# EasyEDA Pro project Chassis924.epro

# Schematic Schematic1
Create Date: 2024-09-16; Page Name: P1; Project Name: 底盘控制模块916; Schematic Name: Schematic1; Update Date: 2024-09-16; Company: 嘉立创EDA; Page Size: A4; Version: V1.0
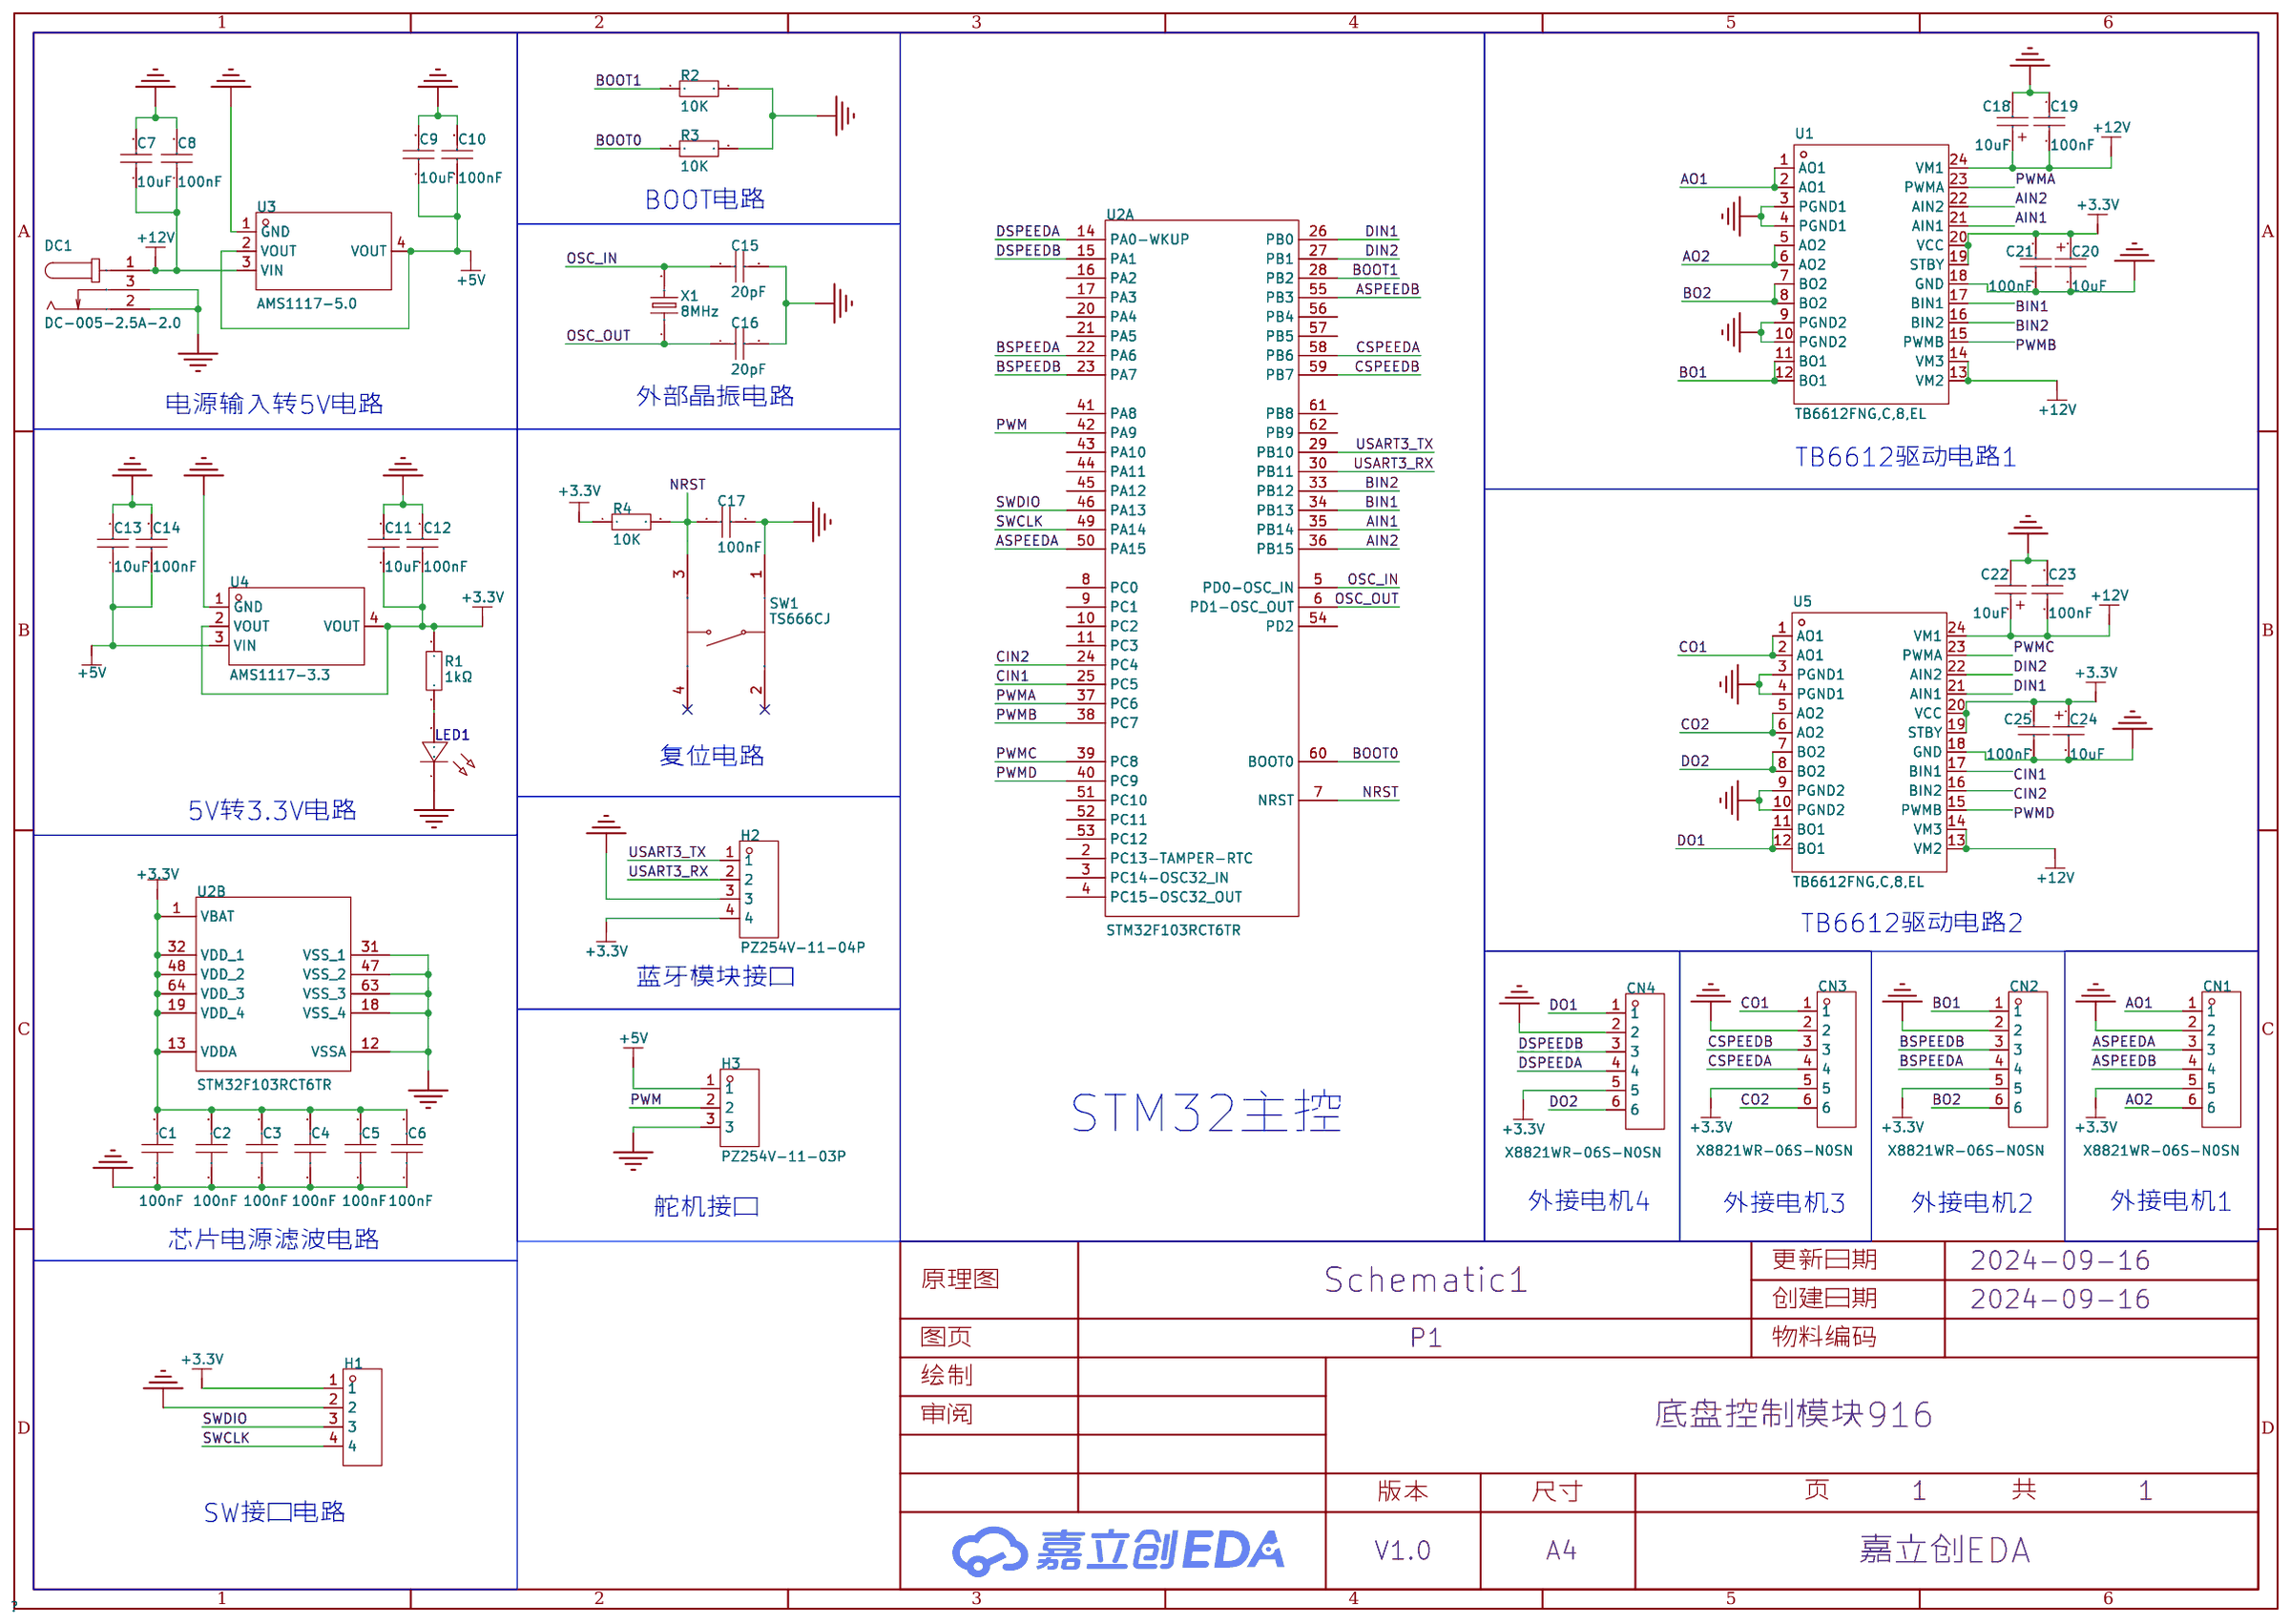
[diagram p0: schematic sheet]

## Parts
C1  100nF  [C0603]
C2  100nF  [C0603]
C3  100nF  [C0603]
C4  100nF  [C0603]
C5  100nF  [C0603]
C6  100nF  [C0603]
C7  10uF  [C0402]
C8  100nF  [C0402]
C9  10uF  [C0402]
C10  100nF  [C0402]
C11  10uF  [C0402]
C12  100nF  [C0402]
C13  10uF  [C0402]
C14  100nF  [C0402]
C15  20pF  [C0402]
C16  20pF  [C0402]
C17  100nF  [C0402]
C18  10uF  [CAP-SMD_L3.2-W1.6-RD-C7171]
C19  100nF  [C0402]
C20  10uF  [CAP-SMD_L3.2-W1.6-RD-C7171]
C21  100nF  [C0402]
C22  10uF  [CAP-SMD_L3.2-W1.6-RD-C7171]
C23  100nF  [C0402]
C24  10uF  [CAP-SMD_L3.2-W1.6-RD-C7171]
C25  100nF  [C0402]
CN1  X8821WR-06S-N0SN  [CONN-TH_6P-P2.50_X8821WR-06S-N2SN]
CN2  X8821WR-06S-N0SN  [CONN-TH_6P-P2.50_X8821WR-06S-N2SN]
CN3  X8821WR-06S-N0SN  [CONN-TH_6P-P2.50_X8821WR-06S-N2SN]
CN4  X8821WR-06S-N0SN  [CONN-TH_6P-P2.50_X8821WR-06S-N2SN]
DC1  DC-005-2.5A-2.0  [CONN-TH_DC-005-2.5A-2.0]
H1  -  [HDR-TH_4P-P2.54-V-M]
H2  PZ254V-11-04P  [HDR-TH_4P-P2.54-V-M]
H3  PZ254V-11-03P  [HDR-TH_3P-P2.54-V-M]
LED1  -  [LED_0805]
R1  1kΩ  [R0603]
R2  10K  [R0603]
R3  10K  [R0603]
R4  10K  [R0603]
SW1  TS666CJ  [SW-TH_4P-L6.0-W6.0-P4.50-LS6.5]
U1  TB6612FNG,C,8,EL  [SSOP-24_L8.3-W5.6-P0.65-LS7.6-BL]
U2  STM32F103RCT6TR  [LQFP-64_L10.0-W10.0-P0.50-LS12.0-BL]  (sections 1,2)
U3  AMS1117-5.0  [SOT-223_L6.5-W3.5-P2.30-LS7.0-BR]
U4  AMS1117-3.3  [SOT-223-3_L6.5-W3.4-P2.30-LS7.0-BR]
U5  TB6612FNG,C,8,EL  [SSOP-24_L8.3-W5.6-P0.65-LS7.6-BL]
X1  8MHz  [HC-49US_L11.5-W4.5-P4.88]

## Library data of the parts
C1-C6 = CAP_0603: Supplier Footprint: 0603
C7 C9 C11 C13 = CL05A106MQ5NUNC: 容值:10uF;精度:±20%;额定电压:6.3V;材质(温度系数):X5R;; LCSC Part Name: 10uF ±20% 6.3V; Supplier Part: C15525; Manufacturer: SAMSUNG(三星); Supplier Footprint: 0402; JLCPCB Part Class: 基础库; Datasheet: https://atta.szlcsc.com/upload/public/pdf/source/20220823/2B02EE04F8F211D38A52DCB16EB6BEBA.pdf; Supplier: LCSC; Tolerance: ±20%; Voltage Rated: 6.3V; Temperature Coefficient: X5R
C8 C10 C12 C14 C17 C19 C21 C23 C25 = CL05B104KO5NNNC: 容值:100nF;精度:±10%;额定电压:16V;材质(温度系数):X7R;; LCSC Part Name: 100nF ±10% 16V; Supplier Part: C1525; Manufacturer: SAMSUNG(三星); Supplier Footprint: 0402; JLCPCB Part Class: 基础库; Datasheet: https://atta.szlcsc.com/upload/public/pdf/source/20160218/1457707763339.pdf; Supplier: LCSC; Tolerance: ±10%; Voltage Rated: 16V; Temperature Coefficient: X7R
C15 C16 = 0402CG200J500NT: 容值:20pF;精度:±5%;额定电压:50V;材质(温度系数):C0G;; LCSC Part Name: 20pF ±5% 50V; Supplier Part: C1554; Manufacturer: FH(风华); Supplier Footprint: 0402; JLCPCB Part Class: 基础库; Datasheet: https://atta.szlcsc.com/upload/public/pdf/source/20200305/C486355_26A10D38EF8C2A5C37091D0039909270.pdf; Supplier: LCSC; Tolerance: ±5%; Voltage Rated: 50V; Temperature Coefficient: C0G
C18 C20 C22 C24 = TAJA106K016RNJ: 容值:10uF;精度:±10%;额定电压:16V;等效串联电阻:3Ω@100kHz;; LCSC Part Name: 10uF ±10% 16V; Supplier Part: C7171; Manufacturer: Kyocera AVX; Supplier Footprint: CASE-A-3216; JLCPCB Part Class: 基础库; Datasheet: https://atta.szlcsc.com/upload/public/pdf/source/20160107/1457707750344.pdf; Supplier: LCSC; Tolerance: ±10%; Rated Voltage: 16V; Equivalent Series Resistance(ESR): 3Ω@100kHz; Operating Temperature: -55℃~+125℃
CN1-CN4 = X8821WR-06S-N0SN: 插针结构:1x6P;间距:2.5mm;安装方式:弯插;参考系列:XH;总PIN数:6P;排数:1;每排PIN数:6;行距:-;额定电流:3A;触头材质:黄铜;触头镀层:锡;工作温度范围:-;; LCSC Part Name: 1x6P 间距:2.5mm 弯插 系列:XH; Supplier Part: C388743; Manufacturer: XKB Connection(中国星坤); Supplier Footprint: 弯插,P=2.54mm; JLCPCB Part Class: 扩展库; Datasheet: https://atta.szlcsc.com/upload/public/pdf/source/20211009/984C14C41D2B1156BCF8EEF5D296E395.pdf; Supplier: LCSC; Pins Structure: 1x6P; Pitch: 2.5mm; Mounting Style: 弯插; Reference Series: XH; Number of Pins: 6P; Number of Rows: 1; Number of PINs Per Row: 6; Current Rating (Max): 3A; Contact Material: 黄铜; Contact Plating: 锡
DC1 = DC-005-2.5A-2.0: 连接器类型:DC电源插座;安装方式:面板安装;触点内径:2mm;触点外径:6.2mm;额定电流:-;额定电压:-;触头材质:黄铜;触头镀层:-;工作温度范围:-20℃~+70℃;焊接温度(最大值):260℃;; LCSC Part Name: DC电源插座 内径:2mm 外径:6.2mm; Supplier Part: C319099; Manufacturer: XKB Connection(中国星坤); Supplier Footprint: 插件; JLCPCB Part Class: 扩展库; Datasheet: https://atta.szlcsc.com/upload/public/pdf/source/20230410/3C172F25A51FCA230ABE6D36425CBB3B.pdf; Supplier: LCSC; Connector Type: DC电源插座; Mounting Style: 面板安装; Inside Contact Diameter: 2mm; Outside Contact Diameter: 6.2mm; Contact Material: 黄铜; Operating Temperature Range: -20℃~+70℃; Soldering Temperature(Max): 260℃
H1 = HDR-M_2.54_1x4P: Supplier Part: C492403; Supplier Footprint: 插件
H2 = PZ254V-11-04P: 插针结构:1x4P;间距:2.54mm;行距:-;圆针/方针:方针;安装类型:直插;排数:单排;总PIN位数:4P;额定电流:3A;额定电压:250V;配合针长度:6mm;塑高:2.5mm;端接针长度:3mm;触头材质:-;工作温度范围:-40℃~+105℃;颜色:黑色;; LCSC Part Name: 间距:2.54mm 1x4P 直插 方针; Supplier Part: C2691448; Manufacturer: XFCN(兴飞); Supplier Footprint: 插件,P=2.54mm; JLCPCB Part Class: 扩展库; Datasheet: https://atta.szlcsc.com/upload/public/pdf/source/20200309/C492403_F9F19131791D08044AD4F84F8E751A34.pdf; Supplier: LCSC; Pin Structure: 1x4P; Pitch: 2.54mm; Circluar Pins/Square Pins: 方针; Mounting Type: 直插; Number of Rows: 单排; Number of Pins: 4P; Current Rating (Max): 3A; Voltage Rating (Max): 250V; Length of Mating Pin: 6mm; Insulation Height: 2.5mm; Length of End Connection Pin: 3mm; Operating Temperature Range: -40℃~+105℃; Color: 黑色
H3 = PZ254V-11-03P: 插针结构:1x3P;间距:2.54mm;行距:-;圆针/方针:方针;安装类型:直插;排数:单排;总PIN位数:3P;额定电流:3A;额定电压:250V;配合针长度:6mm;塑高:2.5mm;端接针长度:3mm;工作温度范围:-40℃~+105℃;颜色:黑色;; LCSC Part Name: 间距:2.54mm 1x3P 直插 方针; Supplier Part: C2937625; Manufacturer: XFCN(兴飞); Supplier Footprint: 插件,P=2.54mm; JLCPCB Part Class: 扩展库; Datasheet: https://atta.szlcsc.com/upload/public/pdf/source/20200309/C492402_8335C3D49C4E4C618838D59BB1D024C1.pdf; Supplier: LCSC; Pin Structure: 1x3P; Pitch: 2.54mm; Circluar Pins/Square Pins: 方针; Mounting Type: 直插; Number of Rows: 单排; Number of Pins: 3P; Current Rating (Max): 3A; Voltage Rating (Max): 250V; Length of Mating Pin: 6mm; Insulation Height: 2.5mm; Length of End Connection Pin: 3mm; Operating Temperature Range: -40℃~+105℃; Color: 黑色
LED1 = LED_0805-B: Supplier Footprint: 0805
R1 = 0603WAF1001T5E: 电阻类型:厚膜电阻;阻值:1kΩ;精度:±1%;功率:100mW;最大工作电压:75V;温度系数:±100ppm/℃;; LCSC Part Name: 1kΩ ±1% 100mW 厚膜电阻; Supplier Part: C21190; Manufacturer: UNI-ROYAL(厚声); Supplier Footprint: 0603; JLCPCB Part Class: 基础库; Datasheet: https://atta.szlcsc.com/upload/public/pdf/source/20200306/C422600_1E6D84923E4A46A82E41ADD87F860B5C.pdf; Supplier: LCSC; Type: 厚膜电阻; Tolerance: ±1%; Power(Watts): 100mW; Overload Voltage (Max): 75V; Temperature Coefficient: ±100ppm/℃; Operating Temperature Range: -55℃~+155℃
R2-R4 = Res_0603: Supplier Footprint: 0603
SW1 = TS666CJ: 电路结构:单刀单掷;按钮形状:圆形按钮;作用力:250gf;安装方式:直插;开关长度:6mm;开关宽度:6mm;开关高度:6mm;带支架:不带;触点电流:50mA;额定电压(DC):12V;绝缘电阻:100MΩ;机械寿命:5万次;; LCSC Part Name: 6*6*6mm 直插 轻触开关; Supplier Part: C557621; Manufacturer: SHOU HAN(首韩); Supplier Footprint: 插件; JLCPCB Part Class: 扩展库; Datasheet: https://atta.szlcsc.com/upload/public/pdf/source/20200519/C557621_524FC94A9E7193E97F84899CC7F1F8B2.pdf; Supplier: LCSC; Circuit: 单刀单掷; Actuator Style: 圆形按钮; Operating Force: 250gf; Mounting Style: 直插; Switch Length: 6mm; Switch Width: 6mm; Switch Height: 6mm; Strike Gundam: 不带; Contact Current: 50mA; Voltage Rating (DC): 12V; Insulation Resistance: 100MΩ; Actuator/Cap Color: 黑色; Pin Style: PC引脚; Mechanical Life: 5万次; Operating Temperature: -20℃~+85℃
U1 U5 = TB6612FNG,C,8,EL: LCSC Part Name: 1A 有刷直流电机驱动芯片 5.5V; Supplier Part: C141517; Manufacturer: TOSHIBA(东芝); Supplier Footprint: SSOP-24; JLCPCB Part Class: 扩展库; Datasheet: https://atta.szlcsc.com/upload/public/pdf/source/20171128/C141517_15118625624231147036.pdf; Supplier: LCSC
U2 = STM32F103RCT6TR: CPU内核:ARM-M3;程序存储容量:256KB;RAM总容量:48KB;GPIO端口数量:51;工作电压范围:2V~3.6V;CPU最大主频:72MHz;程序存储器类型:FLASH;; LCSC Part Name: 主流增强型ARM Cortex-M3 MCU，具有256 KB Flash、72 MHz CPU、电机控制、USB和CAN; Supplier Part: C39704; Manufacturer: ST(意法半导体); Supplier Footprint: LQFP-64(10x10); JLCPCB Part Class: 扩展库; Datasheet: https://atta.szlcsc.com/upload/public/pdf/source/20151012/1457707442737.pdf; Supplier: LCSC; CPU Core: ARM-M3; Program Storage Size: 256KB; RAM Size: 48KB; GPIO Ports Number: 51; Operating Voltage Range: 2V~3.6V; CPU Maximum Speed: 72MHz; Program Memory Type: FLASH; Operating Temperature Range: -40℃~+85℃; ADC (Bit): 12bit; DAC (Bit): 12bit; Universal Serial Bus: 有; Peripheral/Function: 看门狗；DMA；看门狗；温度传感器; Watchdog: 有; Infrared Data Association: 有; Low-Voltage Detect: 有; Direct Memory Access: 有; Internal Oscillator: 有
U3 = AMS1117-5.0_C6187: 输出类型:固定;最大输入电压:12V;输出电压:5V;最大输出电流:1A;电源纹波抑制比(PSRR):68dB@(120Hz);输出极性:正极;; LCSC Part Name: 输入12V 输出5V 1A; Supplier Part: C6187; Manufacturer: AMS; Supplier Footprint: SOT-223; JLCPCB Part Class: 基础库; Datasheet: https://atta.szlcsc.com/upload/public/pdf/source/20230918/E4B716057EE82179D88E8A0894830D59.pdf; Supplier: LCSC; Output Type: 固定; Maximum Input Voltage: 12V; Output Voltage: 5V; MAX Output Current: 1A; Power Supply Rejection Ratio (PSRR): 68dB@(120Hz); Dropout Voltage: 1.3V@(1A); Output Polarity: 正极; Number of Outputs: 1
U4 = AMS1117-3.3_C6186: 输出类型:固定;最大输入电压:-;输出电压:3.3V;最大输出电流:1A;电源纹波抑制比(PSRR):72dB@(120Hz);输出极性:正极;; LCSC Part Name: 输出3.3V 1A; Supplier Part: C6186; Manufacturer: AMS; Supplier Footprint: SOT-223; JLCPCB Part Class: 基础库; Datasheet: https://atta.szlcsc.com/upload/public/pdf/source/20180727/C6186_7A095716F0823C02F1997A905E26C086.pdf; Supplier: LCSC; Output Type: 固定; Output Voltage: 3.3V; MAX Output Current: 1A; Power Supply Rejection Ratio (PSRR): 72dB@(120Hz); Dropout Voltage: 1.3V@(800mA); Output Polarity: 正极; Number of Outputs: 1
X1 = 49S-8.000-20-20-20/A: 晶振类型:直插晶振;频率:8MHz;常温频差:±20ppm;外接负载电容:20pF;频率稳定度(全温):±20ppm;; LCSC Part Name: 8MHz ±20ppm 20pF; Supplier Part: C240916; Manufacturer: LIMING(利明); Supplier Footprint: HC-49S; JLCPCB Part Class: 扩展库; Datasheet: https://atta.szlcsc.com/upload/public/pdf/source/20180930/C240954_D21D826943E58A9880472B1227802F84.pdf; Supplier: LCSC; Crystal Type: 直插晶振; Normal temperature Frequency Tolerance: ±20ppm; External load capacitor: 20pF; Frequency Stability(Full temperature range): ±20ppm; Operating Temperature: -20℃~+70℃

## Nets
+3.3V: C1.2 C2.2 C3.2 C4.2 C5.2 C6.2 C11.1 C12.1 C20.1 C21.1 C24.1 C25.1 CN1.5 CN2.5 CN3.5 CN4.5 H1.1 H2.4 R1.1 R4.1 U1.19(STBY) U1.20(VCC) U2.1(VBAT) U2.13(VDDA) U2.19(VDD_4) U2.32(VDD_1) U2.48(VDD_2) U2.64(VDD_3) U4.2(VOUT) U4.4(VOUT) U5.19(STBY) U5.20(VCC)
+5V: C9.1 C10.1 C13.1 C14.1 H3.1 U3.2(VOUT) U3.4(VOUT) U4.3(VIN)
+12V: C7.1 C8.1 C18.1 C19.1 C22.1 C23.1 DC1.1 U1.13(VM2) U1.14(VM3) U1.24(VM1) U3.3(VIN) U5.13(VM2) U5.14(VM3) U5.24(VM1)
GND: C1.1 C2.1 C3.1 C4.1 C5.1 C6.1 C7.2 C8.2 C9.2 C10.2 C11.2 C12.2 C13.2 C14.2 C15.2 C16.2 C17.1 C18.2 C19.2 C20.2 C21.2 C22.2 C23.2 C24.2 C25.2 CN1.2 CN2.2 CN3.2 CN4.2 DC1.2 DC1.3 H1.2 H2.3 H3.3 LED1.1(C) R2.2 R3.2 SW1.1(A) U1.3(PGND1) U1.4(PGND1) U1.9(PGND2) U1.10(PGND2) U1.18(GND) U2.12(VSSA) U2.18(VSS_4) U2.31(VSS_1) U2.47(VSS_2) U2.63(VSS_3) U3.1(GND) U4.1(GND) U5.3(PGND1) U5.4(PGND1) U5.9(PGND2) U5.10(PGND2) U5.18(GND)
AIN1: U1.21(AIN1) U2.35(PB14)
AIN2: U1.22(AIN2) U2.36(PB15)
AO1: CN1.1 U1.1(AO1) U1.2(AO1)
AO2: CN1.6 U1.5(AO2) U1.6(AO2)
ASPEEDA: CN1.3 U2.50(PA15)
ASPEEDB: CN1.4 U2.55(PB3)
BIN1: U1.17(BIN1) U2.34(PB13)
BIN2: U1.16(BIN2) U2.33(PB12)
BO1: CN2.1 U1.11(BO1) U1.12(BO1)
BO2: CN2.6 U1.7(BO2) U1.8(BO2)
BOOT0: R3.1 U2.60(BOOT0)
BOOT1: R2.1 U2.28(PB2)
BSPEEDA: CN2.4 U2.22(PA6)
BSPEEDB: CN2.3 U2.23(PA7)
CIN1: U2.25(PC5) U5.17(BIN1)
CIN2: U2.24(PC4) U5.16(BIN2)
CO1: CN3.1 U5.1(AO1) U5.2(AO1)
CO2: CN3.6 U5.5(AO2) U5.6(AO2)
CSPEEDA: CN3.4 U2.58(PB6)
CSPEEDB: CN3.3 U2.59(PB7)
DIN1: U2.26(PB0) U5.21(AIN1)
DIN2: U2.27(PB1) U5.22(AIN2)
DO1: CN4.1 U5.11(BO1) U5.12(BO1)
DO2: CN4.6 U5.7(BO2) U5.8(BO2)
DSPEEDA: CN4.4 U2.14(PA0-WKUP)
DSPEEDB: CN4.3 U2.15(PA1)
NRST: C17.2 R4.2 SW1.3(C) U2.7(NRST)
OSC_IN: C15.1 U2.5(PD0-OSC_IN) X1.2
OSC_OUT: C16.1 U2.6(PD1-OSC_OUT) X1.1
PWM: H3.2 U2.42(PA9)
PWMA: U1.23(PWMA) U2.37(PC6)
PWMB: U1.15(PWMB) U2.38(PC7)
PWMC: U2.39(PC8) U5.23(PWMA)
PWMD: U2.40(PC9) U5.15(PWMB)
SWCLK: H1.4 U2.49(PA14)
SWDIO: H1.3 U2.46(PA13)
USART3_RX: H2.2 U2.30(PB11)
USART3_TX: H2.1 U2.29(PB10)
$1N661: LED1.2(A) R1.2

Not connected (* = marked no-connect by the designer): SW1 2(B)* 4(D)*; U2 2(PC13-TAMPER-RTC) 3(PC14-OSC32_IN) 4(PC15-OSC32_OUT) 8(PC0) 9(PC1) 10(PC2) 11(PC3) 16(PA2) 17(PA3) 20(PA4) 21(PA5) 41(PA8) 43(PA10) 44(PA11) 45(PA12) 51(PC10) 52(PC11) 53(PC12) 54(PD2) 56(PB4) 57(PB5) 61(PB8) 62(PB9)

## Notes on the sheet
- BOOT电路
- 外部晶振电路
- 电源输入转5V电路
- TB6612驱动电路1
- 复位电路
- 5V转3.3V电路
- TB6612驱动电路2
- 蓝牙模块接口
- STM32主控
- 舵机接口
- 外接电机4
- 外接电机3
- 外接电机2
- 外接电机1
- 芯片电源滤波电路
- SW接口电路

# Board PCB1
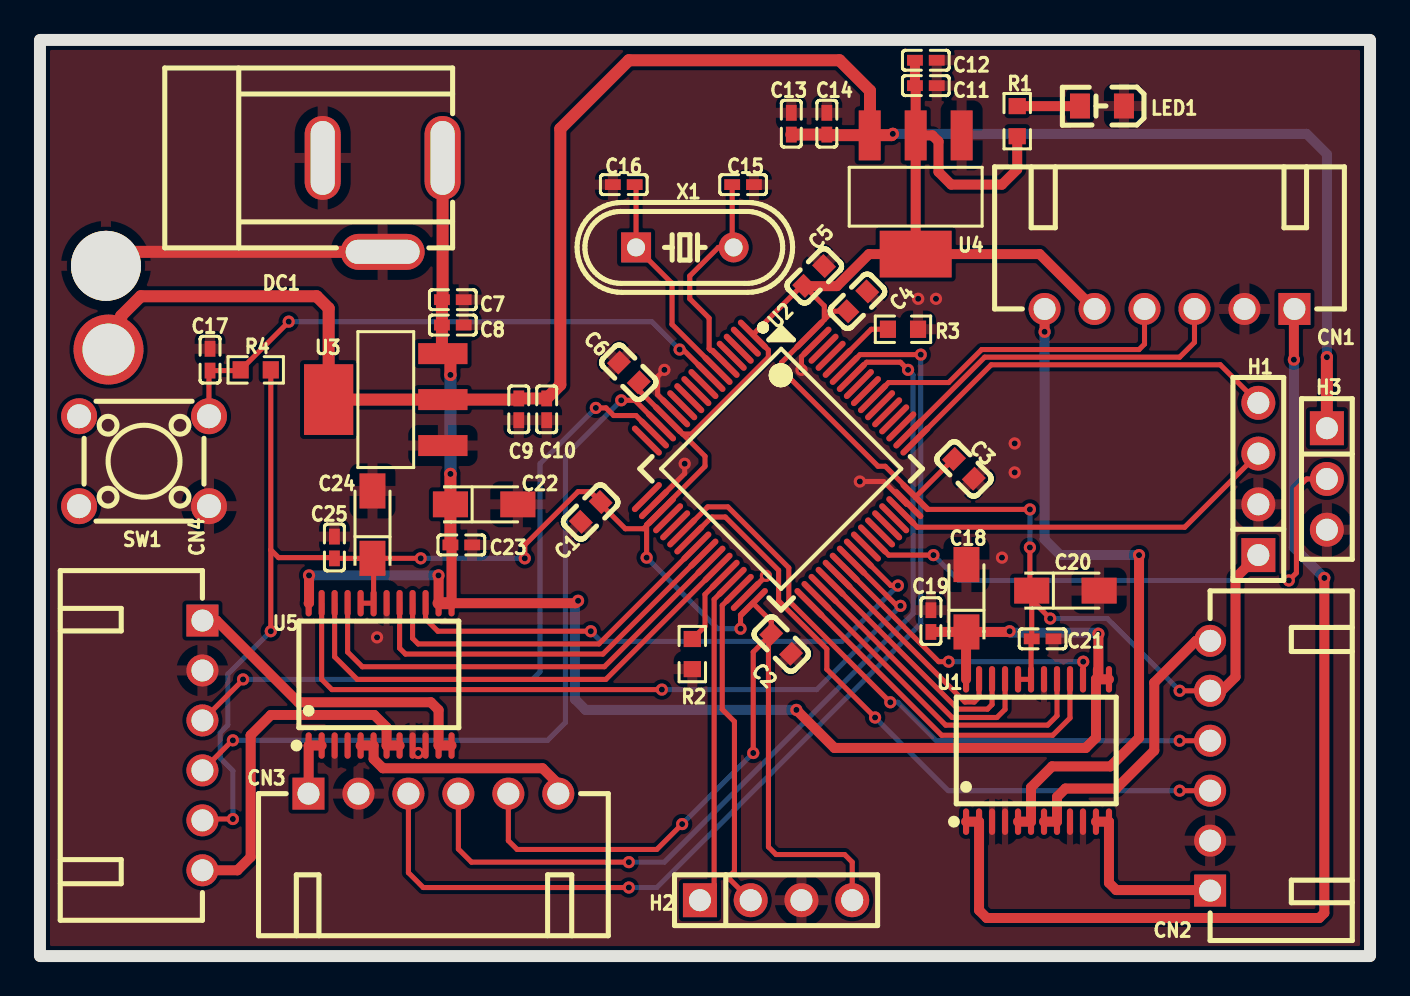
[diagram p1: board, top side]
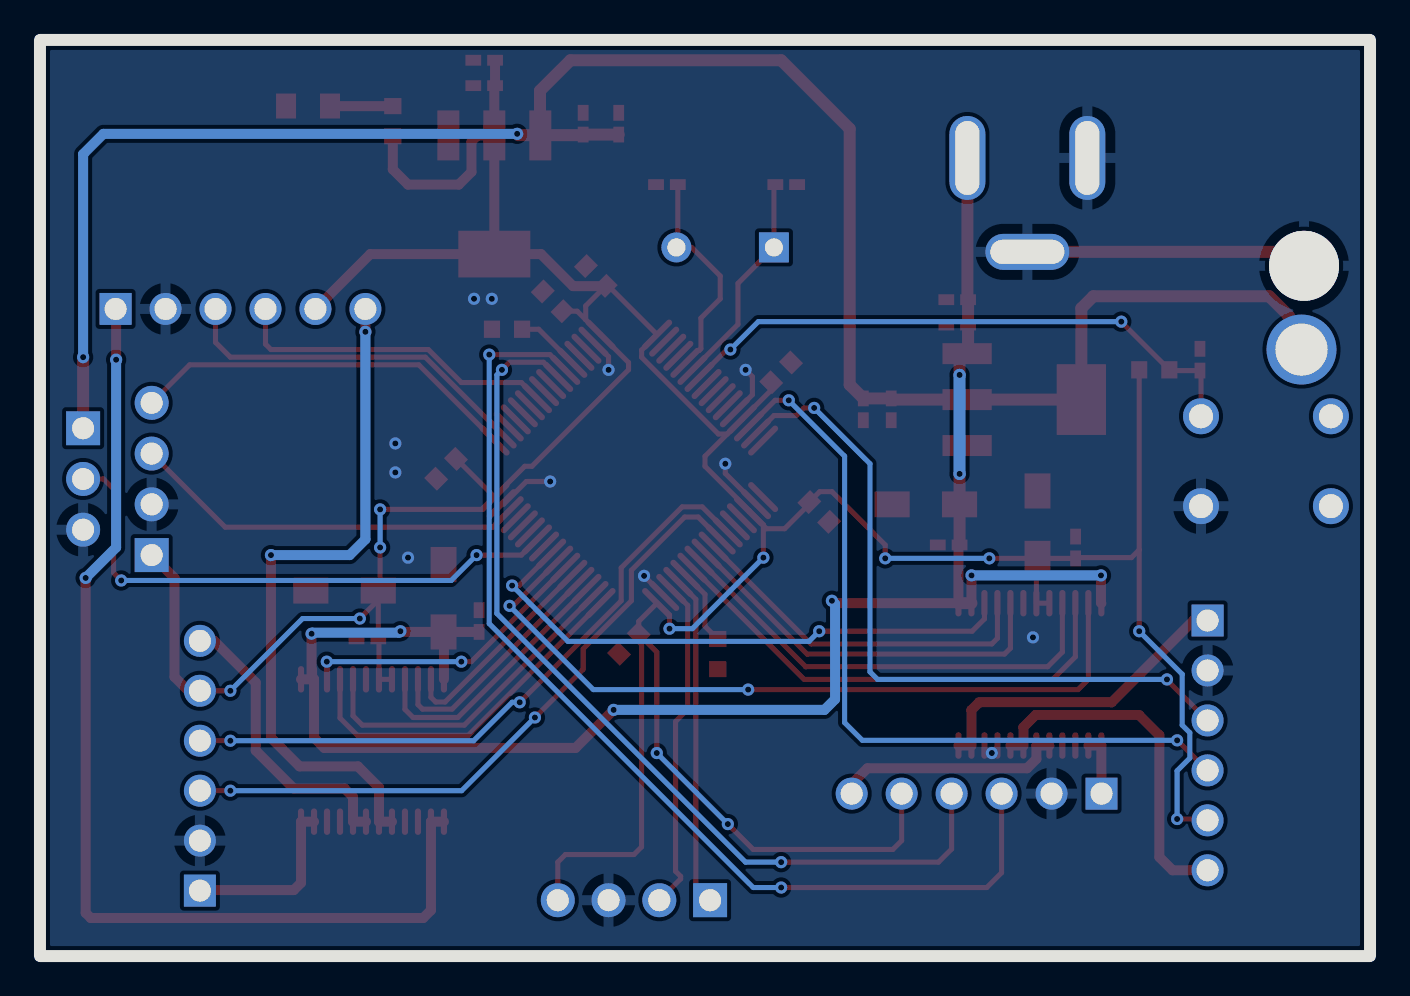
[diagram p2: board, bottom side, seen from below]

Outline 66.55 x 45.85 mm; copper layers: Top Layer, Bottom Layer. Coordinates in mm from the lower left corner of the outline.
Outline path: rectangle 0,45.85 66.55,0
Stack: Top Layer 0.035mm / Dielectric1 1.51mm FR4 er 4.5 / Bottom Layer 0.035mm

## Design rules (mm)
net SWDIO: DP2
net SWCLK: DP2
net OSC_IN: DP1
net OSC_OUT: DP1
net USART3_RX: DP3
net USART3_TX: DP3
template: JLCPCB Capability(Two Layers Board)
spacing copperThickness1oz (default): track to track 0.102, other pairs 0.152 to 0.3
spacing copperThickness2oz: track to track 0.203, other pairs 0.152 to 0.3
track width copperThickness1oz (default): min 0.127, default 0.254, max 2.54
track width copperThickness2oz: min 0.203, default 0.254, max 2.54
differential pair differentialPair (default): width min 0.127, default 0.254, max 2.54; gap min 0.152, default 0.152
via viaSize (default): diameter min 0.5, default 0.61, max 10; hole min 0.3, default 0.305, max 6.3

## Placement (name value [footprint] x y rotation side)
C1  100nF  [C0603]  27.56 22.23 45 top
C2  100nF  [C0603]  37.08 15.62 135 top
C3  100nF  [C0603]  46.23 24.38 135 top
C4  100nF  [C0603]  40.89 32.77 225 top
C5  100nF  [C0603]  38.74 34.04 225 top
C6  100nF  [C0603]  29.46 29.21 315 top
C7  10uF  [C0402]  20.66 32.85 0 top
C8  100nF  [C0402]  20.66 31.58 0 top
C9  10uF  [C0402]  23.96 27.36 270 top
C10  100nF  [C0402]  25.35 27.36 270 top
C11  10uF  [C0402]  44.32 43.56 0 top
C12  100nF  [C0402]  44.32 44.83 0 top
C13  10uF  [C0402]  37.59 41.66 90 top
C14  100nF  [C0402]  39.37 41.66 90 top
C15  20pF  [C0402]  35.18 38.61 0 top
C16  20pF  [C0402]  29.21 38.61 180 top
C17  100nF  [C0402]  8.51 29.84 270 top
C18  10uF  [CAP-SMD_L3.2-W1.6-RD-C7171]  46.36 17.91 90 top
C19  100nF  [C0402]  44.58 16.76 90 top
C20  10uF  [CAP-SMD_L3.2-W1.6-RD-C7171]  51.31 18.29 0 top
C21  100nF  [C0402]  50.16 15.88 0 top
C22  10uF  [CAP-SMD_L3.2-W1.6-RD-C7171]  22.22 22.61 0 top
C23  100nF  [C0402]  21.08 20.57 0 top
C24  10uF  [CAP-SMD_L3.2-W1.6-RD-C7171]  16.64 21.59 90 top
C25  100nF  [C0402]  14.73 20.45 90 top
CN1  X8821WR-06S-N0SN  [CONN-TH_6P-P2.50_X8821WR-06S-N2SN]  56.52 32.39 180 top
CN2  X8821WR-06S-N0SN  [CONN-TH_6P-P2.50_X8821WR-06S-N2SN]  58.55 9.53 90 top
CN3  X8821WR-06S-N0SN  [CONN-TH_6P-P2.50_X8821WR-06S-N2SN]  19.69 8.13 0 top
CN4  X8821WR-06S-N0SN  [CONN-TH_6P-P2.50_X8821WR-06S-N2SN]  8.13 10.54 270 top
DC1  DC-005-2.5A-2.0  [CONN-TH_DC-005-2.5A-2.0]  17.15 37.59 0 top
H1  -  [HDR-TH_4P-P2.54-V-M]  60.96 23.88 90 top
H2  PZ254V-11-04P  [HDR-TH_4P-P2.54-V-M]  36.83 2.79 0 top
H3  PZ254V-11-03P  [HDR-TH_3P-P2.54-V-M]  64.39 23.88 270 top
LED1  -  [LED_0805]  53.09 42.55 180 top
NOREF  -  [Pad_e1948]  3.43 30.35 0 top
NOREF#2  -  [Pad_e2206]  3.3 34.54 0 top
R1  1kΩ  [R0603]  48.9 41.78 90 top
R2  10K  [R0603]  32.64 15.11 270 top
R3  10K  [R0603]  43.18 31.37 0 top
R4  10K  [R0603]  10.8 29.34 180 top
SW1  TS666CJ  [SW-TH_4P-L6.0-W6.0-P4.50-LS6.5]  5.21 24.77 180 top
U1  TB6612FNG,C,8,EL  [SSOP-24_L8.3-W5.6-P0.65-LS7.6-BL]  49.91 10.29 0 top
U2  STM32F103RCT6TR  [LQFP-64_L10.0-W10.0-P0.50-LS12.0-BL]  37.08 24.38 225 top
U3  AMS1117-5.0  [SOT-223_L6.5-W3.5-P2.30-LS7.0-BR]  17.3 27.85 0 top
U4  AMS1117-3.3  [SOT-223-3_L6.5-W3.4-P2.30-LS7.0-BR]  43.81 38.1 90 top
U5  TB6612FNG,C,8,EL  [SSOP-24_L8.3-W5.6-P0.65-LS7.6-BL]  17.02 14.1 0 top
X1  8MHz  [HC-49US_L11.5-W4.5-P4.88]  32.27 35.46 0 top

## Footprints (pads in the part's own frame, mm; a bottom-side part is the same pattern mirrored in y, then rotated)
C0402
  rect 0.79x0.54 smd: 1(-0.545,0) 2(0.545,0)
C0603
  rect 0.8x0.9 smd: 1(-0.7,0) 2(0.7,0)
CAP-SMD_L3.2-W1.6-RD-C7171
  rect 1.758x1.296 smd: 1(-1.687,0) 2(1.687,0)
CONN-TH_6P-P2.50_X8821WR-06S-N2SN
  rect 1.6x1.6 hole 1.1: 1(-6.25,0)
  round 1.6 hole 1.1: 2(-3.75,0) 3(-1.25,0) 4(1.25,0) 5(3.75,0) 6(6.25,0)
CONN-TH_DC-005-2.5A-2.0
  oval 1.8x4.2 hole 1.2x3.7: 1(2.999,2.35) 2(-2.999,2.35)
  oval 4.2x1.8 hole 3.7x1.2: 3(0,-2.35)
HC-49US_L11.5-W4.5-P4.88
  rect 1.5x1.5 hole 0.9: 1(-2.44,0)
  round 1.5 hole 0.9: 2(2.44,0)
HDR-TH_3P-P2.54-V-M
  rect 1.7x1.7 hole 1.1: 1(-2.54,0)
  round 1.7 hole 1.1: 2(0,0) 3(2.54,0)
HDR-TH_4P-P2.54-V-M
  rect 1.7x1.7 hole 1.1: 1(-3.81,0)
  round 1.7 hole 1.1: 2(-1.27,0) 3(1.27,0) 4(3.81,0)
LED_0805
  rect 1x1.25 smd: 1(-1.15,0.005) 2(1.05,0.005)
LQFP-64_L10.0-W10.0-P0.50-LS12.0-BL
  oval 0.3x2 smd: 1(-3.75,-5.75) 2(-3.25,-5.75) 3(-2.75,-5.75) 4(-2.25,-5.75) 5(-1.75,-5.75) 6(-1.25,-5.75) 7(-0.75,-5.75) 8(-0.25,-5.75) 9(0.25,-5.75) 10(0.75,-5.75) 11(1.25,-5.75) 12(1.75,-5.75) 13(2.25,-5.75) 14(2.75,-5.75) 15(3.25,-5.75) 16(3.75,-5.75) 33(3.75,5.75) 34(3.25,5.75) 35(2.75,5.75) 36(2.25,5.75) 37(1.75,5.75) 38(1.25,5.75) 39(0.75,5.75) 40(0.25,5.75) 41(-0.25,5.75) 42(-0.75,5.75) 43(-1.25,5.75) 44(-1.75,5.75) 45(-2.25,5.75) 46(-2.75,5.75) 47(-3.25,5.75) 48(-3.75,5.75)
  oval 2x0.3 smd: 17(5.75,-3.75) 18(5.75,-3.25) 19(5.75,-2.75) 20(5.75,-2.25) 21(5.75,-1.75) 22(5.75,-1.25) 23(5.75,-0.75) 24(5.75,-0.25) 25(5.75,0.25) 26(5.75,0.75) 27(5.75,1.25) 28(5.75,1.75) 29(5.75,2.25) 30(5.75,2.75) 31(5.75,3.25) 32(5.75,3.75) 49(-5.75,3.75) 50(-5.75,3.25) 51(-5.75,2.75) 52(-5.75,2.25) 53(-5.75,1.75) 54(-5.75,1.25) 55(-5.75,0.75) 56(-5.75,0.25) 57(-5.75,-0.25) 58(-5.75,-0.75) 59(-5.75,-1.25) 60(-5.75,-1.75) 61(-5.75,-2.25) 62(-5.75,-2.75) 63(-5.75,-3.25) 64(-5.75,-3.75)
Pad_e1948
  round 3.5 hole 2.6: 5(0,0)
Pad_e2206
  round 3.5 hole 3.914x2.6: 6(0,0)
R0603
  rect 0.806x0.864 smd: 1(-0.753,0) 2(0.753,0)
SOT-223-3_L6.5-W3.4-P2.30-LS7.0-BR
  rect 2.5x1.1 smd: 1(2.97,-2.3) 2(2.97,0) 3(2.97,2.3)
  rect 2.34x3.6 smd: 4(-2.97,0)
SOT-223_L6.5-W3.5-P2.30-LS7.0-BR
  rect 2.465x1.05 smd: 1(2.857,-2.3) 2(2.857,0) 3(2.857,2.3)
  rect 2.465x3.54 smd: 4(-2.857,0)
SSOP-24_L8.3-W5.6-P0.65-LS7.6-BL
  oval 0.308x1.324 smd: 1(-3.575,-3.562) 2(-2.925,-3.562) 3(-2.275,-3.562) 4(-1.625,-3.562) 5(-0.975,-3.562) 6(-0.325,-3.562) 7(0.325,-3.562) 8(0.975,-3.562) 9(1.625,-3.562) 10(2.275,-3.562) 11(2.925,-3.562) 12(3.575,-3.562) 13(3.575,3.562) 14(2.925,3.562) 15(2.275,3.562) 16(1.625,3.562) 17(0.975,3.562) 18(0.325,3.562) 19(-0.325,3.562) 20(-0.975,3.562) 21(-1.625,3.562) 22(-2.275,3.562) 23(-2.925,3.562) 24(-3.575,3.562)
SW-TH_4P-L6.0-W6.0-P4.50-LS6.5
  round 1.8 hole 1.2: 1(-3.25,2.25) 2(3.25,2.25) 3(-3.25,-2.25) 4(3.25,-2.25)

## Nets
As in the schematic, except:
+5V: C9.1 C10.1 C13.1 C14.1 H3.1 NOREF.5 U3.2 U3.4 U4.3
GND: C1.1 C2.1 C3.1 C4.1 C5.1 C6.1 C7.2 C8.2 C9.2 C10.2 C11.2 C12.2 C13.2 C14.2 C15.2 C16.2 C17.1 C18.2 C19.2 C20.2 C21.2 C22.2 C23.2 C24.2 C25.2 CN1.2 CN2.2 CN3.2 CN4.2 DC1.2 DC1.3 H1.2 H2.3 H3.3 LED1.1 NOREF#2.6 R2.2 R3.2 SW1.1 U1.3 U1.4 U1.9 U1.10 U1.18 U2.12 U2.18 U2.31 U2.47 U2.63 U3.1 U4.1 U5.3 U5.4 U5.9 U5.10 U5.18

Pads without a net: SW1 2 4; U2 2 3 4 8 9 10 11 16 17 20 21 41 43 44 45 51 52 53 54 56 57 61 62

## Via types
v1: diameter 0.61, hole 0.305, Top Layer to Bottom Layer, 60 vias

## Routing (per net, layer and track width the routed paths; a pad name or vN(x,y) marks a point on that pad's centre or on a via; arc(x,y) is an arc through that point)
+3.3V: length 211
  Top Layer w0.254: 11.55,20.33 11.94,19.94 14.69,19.94 C25.1 16.63,19.9 ; 11.55,20.33 R4.1 ; 11.55,20.33 v1(11.55,16.26) ; 36.45,15.98 36.59,16.12 36.59,16.75 U2.32 35.05,17.05 v1(35.05,16.38) ; 36.45,15.98 36.45,5.46 36.83,5.08 40.26,5.08 40.64,4.7 H2.4 ; 36.45,15.98 35.69,15.21 v1(35.69,10.16) ; 49.62,17.82 C20.1 49.53,18.38 v1(49.53,20.45) ; 49.62,17.82 v1(50.55,16.89) ; 49.62,17.82 49.62,15.88 ; CN2.5 v1(57.02,13.28) ; v1(24.26,19.9) 24.26,20.57 26.92,23.24 27.53,23.24 28.05,22.72 28.05,22.62 29.29,21.39 30.2,21.39 30.35,21.54 ; 31.07,22.31 33.27,24.51 33.27,25.01 32.16,26.13 ; 31.07,22.31 U2.19 30.35,21.54 ; 31.07,22.31 30.35,21.59 30.35,21.54 ; C5.2 38.11,33.54 U2.1 36.44,30.33 36.44,29.97 32.6,26.13 32.16,26.13 ; 39.24,31.85 U2.64 37.1,29.7 37.1,29.34 41.93,24.51 42.29,24.51 43.8,23 U2.48 ; 39.24,31.85 39.67,32.27 C4.2 ; 39.24,31.85 39.24,32.54 38.25,33.53 ; CN3.5 23.44,5.78 23.88,5.33 30.86,5.33 v1(32.13,6.6) ; U2.48 45.71,24.88 45.73,24.88 ; U2.48 44.42,22.35 v1(49.53,22.35) ; U5.20 U5.19 16.69,19.85 C24.1 v1(19.05,19.9) ; 29.96,28.72 29.96,28.33 U2.13 32.16,26.13 ; CN4.5 8.2,6.86 v1(9.65,6.86) ; 30.35,21.54 v1(30.35,19.94) ; C21.1 49.59,15.84 U1.19 U1.20
  Top Layer w0.5: H1.1 59.82,18.92 59.82,13.97 59.12,13.28 CN2.5 ; U4.2 43.81,43.52 C11.1 C12.1 ; U4.2 44.66,41.07 44.96,40.77 44.96,39.24 45.59,38.61 48.13,38.61 48.9,39.37 R1.1 ; U4.2 U4.4 ; U4.4 50.02,35.13 CN1.5 ; U4.4 41.48,35.13 39.88,33.53 38.25,33.53 C5.2
  Bottom Layer w0.254: v1(49.53,22.35) v1(49.53,20.45) ; v1(35.05,16.38) 33.91,16.38 v1(30.35,19.94) ; v1(50.55,16.89) 53.41,16.89 v1(57.02,13.28) ; v1(11.55,16.26) 9.4,14.11 9.4,11.56 9.02,11.18 9.02,9.91 9.65,9.27 v1(9.65,6.86) ; v1(19.05,19.9) v1(24.26,19.9) ; v1(32.13,6.6) v1(35.69,10.16)
+5V: length 102.9
  Top Layer w0.6: v1(64.39,29.97) H3.1 ; 41.53,41.08 39.4,41.08 C14.1 C13.1 ; 41.53,41.08 41.53,43.31 40,44.83 29.46,44.83 26.03,41.4 26.03,28.59 C10.1 C9.1 23.9,27.85 U3.2 U3.4 14.44,32.42 13.84,33.02 5.05,33.02 4.06,32.04 4.06,30.23 ; 41.53,41.08 42.61,41.08 v1(42.67,41.15) ; 41.53,41.08 41.52,41.07
  Bottom Layer w0.5: v1(42.67,41.15) 63.37,41.15 64.39,40.13 v1(64.39,29.97)
+12V: length 87.8
  Top Layer w0.5: v1(13.46,19.05) 13.46,17.68 U5.24 ; v1(37.85,12.32) 39.75,10.41 52.32,10.41 52.84,10.93 U1.14 ; C23.1 20.59,20.52 U5.13 26.8,17.66 v1(26.92,17.78) ; C18.1 44.58,16.22 ; C18.1 46.34,16.2 U1.24 ; C18.1 48.48,16.22 v1(48.51,16.26) ; v1(52.96,16.13) 52.96,13.97 U1.14 ; U5.14 19.94,19.05 v1(19.94,19.05) ; U1.13 U1.14
  Top Layer w0.6: U5.13 U5.14 ; v1(20.54,29.08) 20.54,29.77 U3.3 20.11,30.2 C8.1 C7.1 20.14,32.88 DC1.1 ; v1(20.54,24.13) C23.1
  Bottom Layer w0.5: v1(48.51,16.26) 48.59,16.18 52.9,16.18 v1(52.96,16.13) ; v1(19.94,19.05) v1(13.46,19.05) ; v1(37.85,12.32) 27.3,12.32 26.77,12.85 26.77,17.62 v1(26.92,17.78)
  Bottom Layer w0.6: v1(20.54,24.13) v1(20.54,29.08)
GND: length 25.5
  Top Layer w0.254: v1(31.24,29.34) 30.9,29 30.9,28.09 U2.12 ; v1(32.26,24.64) 32.26,24.15 U2.18 ; U2.31 v1(36.32,19.03) 36.32,19.05 ; v1(38.1,29.34) 38.1,30 38.85,30.75 ; v1(41.02,23.75) 42.22,23.75 43.35,22.62 U2.47
  Top Layer w0.6: DC1.3 4,35.24 NOREF#2.6
  vias: v1(16.87,15.95) v1(18.92,10.16) v1(43.94,32.89) v1(44.83,32.89) v1(48.13,19.94) v1(48.77,25.65) v1(48.77,24.2)
AIN1: length 13.4
  Top Layer w0.254: 39.21,18.37 45.64,11.94 47.88,11.94 48.29,12.34 U1.21
AIN2: length 12.1
  Top Layer w0.254: 39.56,18.73 45.93,12.36 47.41,12.36 47.64,12.58 U1.22
AO1: length 53.5
  Top Layer w0.5: v1(64.26,18.92) 64.26,2.16 64.01,1.91 47.37,1.91 46.99,2.29 U1.2 U1.1 ; v1(62.74,29.84) 62.74,32.36 CN1.1
  Bottom Layer w0.5: v1(62.74,29.84) 62.74,20.45 v1(64.26,18.92)
AO2: length 34.5
  Top Layer w0.5: CN1.6 v1(50.27,31.24) ; U1.5 U1.6 49.59,8.44 50.64,9.49 53.56,9.49 54.99,10.92 v1(54.99,20.07)
  Bottom Layer w0.5: v1(50.27,31.24) 50.27,20.86 51.05,20.07 v1(54.99,20.07)
ASPEEDA: length 17.9
  Top Layer w0.254: U2.50 47.27,29.97 57.02,29.97 57.77,30.71 CN1.3
ASPEEDB: length 16.5
  Top Layer w0.254: U2.55 42.46,28.7 45.47,28.7 47.12,30.35 54.99,30.35 55.27,30.63 CN1.4
BIN1: length 16.7
  Top Layer w0.254: U1.17 50.89,12.02 50.42,11.56 45.31,11.56 U2.34
BIN2: length 18.1
  Top Layer w0.254: U2.33 45.12,11.05 50.67,11.05 51.54,11.91 U1.16
BO1: length 8.9
  Top Layer w0.5: CN2.1 58.52,3.3 53.85,3.3 53.49,3.66 U1.12 U1.11
BO2: length 14.8
  Top Layer w0.5: U1.7 U1.8 50.89,7.96 51.31,8.38 53.85,8.38 55.75,10.29 55.75,13.69 57.84,15.78 CN2.6
BOOT0: length 3.2
  Top Layer w0.254: U2.60 41.59,31.37 R3.1
BOOT1: length 3.9
  Top Layer w0.254: U2.28 33.27,18.1 33.27,16.5 R2.1
BSPEEDA: length 32.8
  Top Layer w0.254: 32.13,21.2 33.41,22.48 34.42,22.48 37.47,19.43 37.47,17.78 v1(42.55,12.7) ; CN2.4 v1(57.02,10.78)
  Bottom Layer w0.254: v1(57.02,10.78) 44.85,10.78 42.93,12.7 v1(42.55,12.7)
BSPEEDB: length 33.7
  Top Layer w0.254: v1(41.78,11.94) 39.37,14.35 39.37,15.37 36.96,17.78 36.96,19.3 34.29,21.97 33.61,21.97 U2.23 ; CN2.3 v1(57.02,8.28)
  Bottom Layer w0.254: v1(41.78,11.94) 45.45,8.28 v1(57.02,8.28)
CIN1: length 19.7
  Top Layer w0.254: U5.17 17.99,15.41 18.29,15.11 28.17,15.11 33.19,20.14
CIN2: length 18.1
  Top Layer w0.254: U5.16 18.64,15.9 18.92,15.62 27.97,15.62 U2.24
CO1: length 3.1
  Top Layer w0.5: U5.2 U5.1 13.44,8.14 CN3.1
CO2: length 11.6
  Top Layer w0.5: CN3.6 25.94,8.61 25.15,9.4 17.16,9.4 16.69,9.86 U5.6 U5.5
CSPEEDA: length 46.5
  Top Layer w0.254: U2.58 41.36,29.72 43.05,29.72 v1(43.43,29.34) ; v1(29.46,4.7) 21.59,4.7 20.94,5.35 CN3.4
  Bottom Layer w0.254: v1(43.43,29.34) 43.69,29.08 43.69,17.15 31.24,4.7 v1(29.46,4.7)
CSPEEDB: length 53
  Top Layer w0.254: v1(44.07,30.1) 41.03,30.1 U2.59 ; CN3.3 18.44,4.17 19.18,3.43 v1(29.46,3.43)
  Bottom Layer w0.254: v1(44.07,30.1) 44.07,16.64 30.86,3.43 v1(29.46,3.43)
DIN1: length 23.1
  Top Layer w0.254: U5.21 15.39,15.21 16.13,14.48 28.24,14.48 33.55,19.79
DIN2: length 24.6
  Top Layer w0.254: U2.27 28.31,13.84 15.88,13.84 14.74,14.98 U5.22
DO1: length 16.1
  Top Layer w0.5: U5.12 U5.11 19.94,12.31 19.56,12.7 12.93,12.7 8.84,16.79 CN4.1
DO2: length 17.8
  Top Layer w0.5: U5.8 17.34,10.53 17.34,11.45 16.72,12.06 11.56,12.06 10.54,11.05 10.54,4.95 9.88,4.29 CN4.6
DSPEEDA: length 39
  Top Layer w0.254: v1(29.08,27.81) 29.77,27.81 U2.14 ; v1(9.65,10.8) 9.63,10.8 CN4.4
  Bottom Layer w0.254: v1(29.08,27.81) 26.29,25.02 26.29,11.68 25.4,10.8 v1(9.65,10.8)
DSPEEDB: length 35.7
  Top Layer w0.254: CN4.3 10.16,13.82 v1(10.16,13.84) ; U2.15 29.82,27.05 28.7,27.05 28.32,27.43 v1(27.81,27.43)
  Bottom Layer w0.254: v1(10.16,13.84) 24.64,13.84 25.02,14.22 25.02,24.64 v1(27.81,27.43)
NRST: length 29.5
  Top Layer w0.254: v1(12.45,31.75) 12.45,31.74 R4.2 10,29.3 C17.2 8.46,29.25 8.46,27.02 ; U2.7 32.18,30.35 v1(32,30.35)
  Bottom Layer w0.254: v1(12.45,31.75) 30.61,31.75 v1(32,30.35)
OSC_IN: length 11.1
  Top Layer w0.254: U2.5 33.63,30.31 33.57,30.31 33.48,30.4 33.48,31.93 32.51,32.89 32.51,34.04 33.94,35.46 X1.2 34.63,35.54 C15.1
OSC_OUT: length 11
  Top Layer w0.254: U2.6 31.62,31.61 31.62,33.67 X1.1 29.83,38.54 C16.1
PWM: length 28.1
  Top Layer w0.254: v1(62.48,18.8) 62.87,19.18 62.87,23.37 63.37,23.88 H3.2 ; U2.42 42.46,20.07 v1(44.7,20.07)
  Bottom Layer w0.254: v1(44.7,20.07) 45.97,18.8 v1(62.48,18.8)
PWMA: length 10.7
  Top Layer w0.254: U1.23 46.99,12.95 46.75,12.71 46.28,12.71 U2.37
PWMB: length 14.8
  Top Layer w0.254: U2.38 44.97,14.73 v1(45.47,14.73) ; v1(52.2,14.73) 52.2,13.86 U1.15
  Bottom Layer w0.254: v1(45.47,14.73) v1(52.2,14.73)
PWMC: length 38.1
  Top Layer w0.254: U5.23 14.09,13.85 14.61,13.34 v1(31.12,13.34) ; v1(43.05,17.53) 42.88,17.53 40.62,19.79
  Bottom Layer w0.254: v1(31.12,13.34) 38.86,13.34 v1(43.05,17.53)
PWMD: length 28.7
  Top Layer w0.254: U5.15 19.29,16.87 19.91,16.26 v1(27.56,16.26) ; v1(42.93,18.54) 42.57,18.54 40.97,20.14
  Bottom Layer w0.254: v1(42.93,18.54) 40.13,15.75 28.07,15.75 v1(27.56,16.26)
SWCLK: length 19.5
  Top Layer w0.254: 43.8,25.8 47.59,29.59 59.06,29.59 H1.4
SWDIO: length 19.7
  Top Layer w0.254: U2.46 43.89,21.46 57.28,21.46 H1.3
USART3_RX: length 16.7
  Top Layer w0.254: 34.96,18.37 34.14,17.55 34.14,12.34 34.75,11.73 34.75,4.24 34.49,3.99 34.49,3.86 H2.2
USART3_TX: length 16.6
  Top Layer w0.254: 34.61,18.73 33.73,17.85 33.73,3.51 H2.1
$1N661: length 3.1
  Top Layer w0.5: R1.2 52.03,42.54 LED1.2

## Copper pours and planes (outline as drawn; the poured copper is in the pictures)
GND on Top Layer: -1.91,47.37 68.45,47.37 68.45,-1.52 -1.91,-1.52
GND on Bottom Layer: -2.79,47.75 67.94,47.75 67.94,-2.41 -2.79,-2.41
